# Altium schematic sheet TeensyCrashDAQ.SchDoc: Microcontroller with Sensors for Servos
size Letter; Author: Prof. Jeremy Daily; Organization: The University of Tulsa; Address1: Mechanical Engineering; Address2: 800 S. Tucker Dr; Address3: Tulsa, OK 74104; DocumentNumber: 1; Revision: 1; SheetNumber: 1; SheetTotal: 1
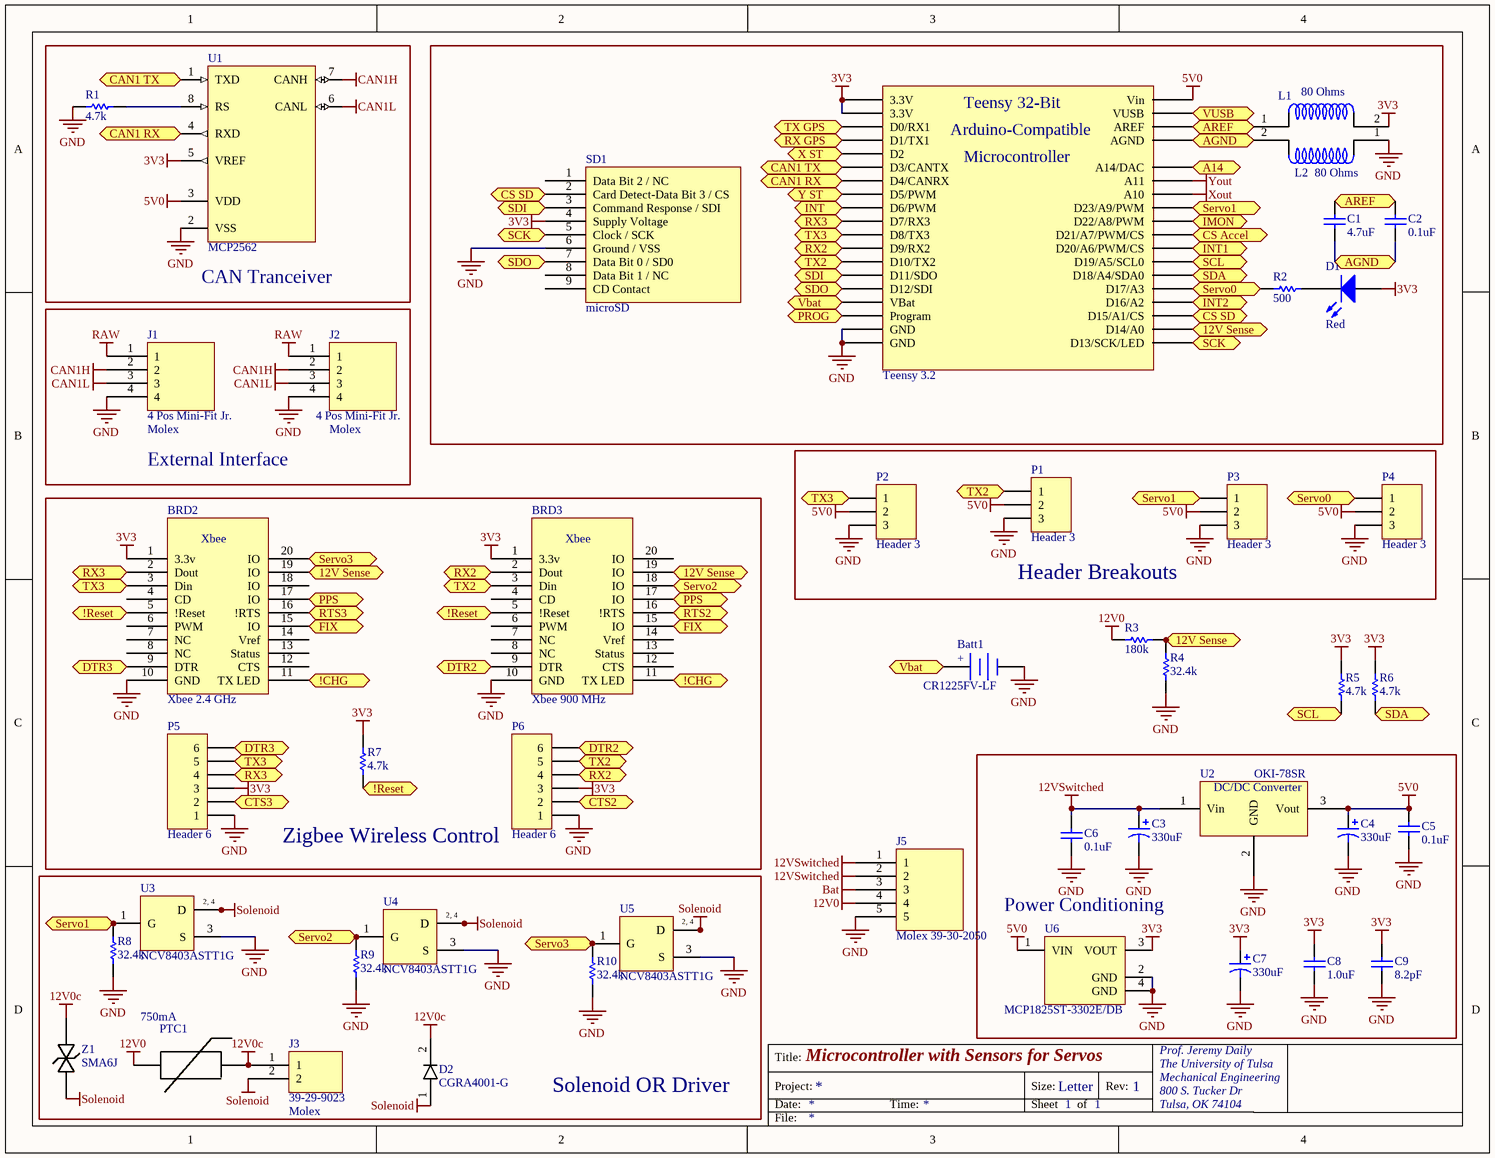
[diagram p0: TeensyCrashDAQ.SchDoc]

## Parts
Batt1  CR1225FV-LF  [Coin Cell with Tabs]
BRD1  Teensy 3.2  [Teensy]
BRD2  Xbee 2.4 GHz  [Xbee]
BRD3  Xbee 900 MHz  [Xbee]
C1  4.7uF  [1206]
C2  0.1uF  [0603]
C3  330uF  [Elec. Cap 5 x 10mm]
C4  330uF  [Elec. Cap 5 x 10mm]
C5  0.1uF  [0603]
C6  0.1uF  [0603]
C7  330uF  [Elec. Cap 5 x 10mm]
C8  1.0uF  [0603]
C9  8.2pF  [0603]
D1  Red  [0805 Polarized]
D2  CGRA4001-G  [SMA with A and K]
J1  4 Pos Mini-Fit Jr.  Manufacturer: Molex  [4 POS Vertical MINI-FIT JR]
J2  4 Pos Mini-Fit Jr.  Manufacturer: Molex  [4 POS Vertical MINI-FIT JR]
J3  39-29-9023  Manufacturer: Molex  [2 POS Vertical MINI-FIT JR]
J5  Molex 39-30-2050  [5 POS Vert MINI-FIT JR]
L1  80 Ohms  [0805]
L2  80 Ohms  [0805]
P1  Header 3  [HDR1X3]
P2  Header 3  [HDR1X3]
P3  Header 3  [HDR1X3]
P4  Header 3  [HDR1X3]
P5  Header 6  [HDR1X6]
P6  Header 6  [HDR1X6]
PTC1  750mA  [2920]
R1  4.7k  [0603]
R2  500  [0603]
R3  180k  [0603]
R4  32.4k  [0603]
R5  4.7k  [0603]
R6  4.7k  [0603]
R7  4.7k  [0603]
R8  32.4k  [0603]
R9  32.4k  [0603]
R10  32.4k  [0603]
SD1  microSD  [SD Card Holder]
U1  MCP2562  [SOIC-8]
U2  OKI-78SR  [78xx]
U3  NCV8403ASTT1G  [ONSC-SOT-223-4-318E-04_V]
U4  NCV8403ASTT1G  [ONSC-SOT-223-4-318E-04_V]
U5  NCV8403ASTT1G  [ONSC-SOT-223-4-318E-04_V]
U6  MCP1825ST-3302E/DB  [SOT-223-DB3_M]
Z1  SMA6J  [SMA]

## Blocks framed on the sheet
CAN Tranceiver: R1 U1
External Interface: J1 J2
Header Breakouts: P1-P4
Zigbee Wireless Control: BRD2 BRD3 P5 P6 R7
Power Conditioning: C3-C9 U2 U6
Solenoid OR Driver: D2 J3 PTC1 R8-R10 U3-U5 Z1

## Ports
12V Sense, !CHG, !Reset, A14, AGND, AREF, CAN1 RX, CAN1 TX, CS Accel, CS SD, CTS2, CTS3, DTR2, DTR3, FIX, IMON, INT, INT1, INT2, PPS, PROG, RTS2, RTS3, RX2, RX3, RX GPS, SCK, SCL, SDA, SDI, SDO, Servo0, Servo1, Servo2, Servo3, TX2, TX3, TX GPS, Vbat, VUSB, X ST, Y ST

## Nets
3V3: BRD1.16(3.3V) BRD1.31(3.3V) BRD2.1(3.3v) BRD3.1(3.3v) C7.1 C8.2 C9.2 D1.1(A) L1.2 P5.3 P6.3 R5.2 R6.2 R7.2 SD1.4(Supply_Voltage) U1.5(VREF) U6.3(VOUT)
5V0: BRD1.33(Vin) C4.1 C5.2 P1.2 P2.2 P3.2 P4.2 U1.3(VDD) U2.3(Vout) U6.1(VIN)
12V0: J5.4 PTC1.1 R3.1
12V0c: D2.2(K) J3.1 PTC1.2 Z1.1(A)
12VSwitched: C3.1 C6.2 J5.1 J5.2 U2.1(Vin)
Bat: J5.3
CAN1H: J1.2 J2.2 U1.7(CANH)
CAN1L: J1.3 J2.3 U1.6(CANL)
GND: Batt1.2(-) BRD1.14(GND) BRD1.17(GND) BRD2.10(GND) BRD3.10(GND) C3.2 C4.2 C5.1 C6.1 C7.2 C8.1 C9.1 J1.4 J2.4 J5.5 L2.1 P1.3 P2.3 P3.3 P4.3 P5.1 P6.1 R1.1 R4.1 R8.1 R9.1 R10.1 SD1.6(Ground_/_VSS) U1.2(VSS) U2.2(GND) U3.3(S) U4.3(S) U5.3(S) U6.2(GND) U6.4(GND)
RAW: J1.1 J2.1
Solenoid: D2.1(A) J3.2 U3.2(D) U3.4(D) U4.2(D) U4.4(D) U5.2(D) U5.4(D) Z1.2(K)
Xout: BRD1.36(A10)
Yout: BRD1.37(A11)
12V Sense: BRD1.21(D14/A0) BRD2.19(IO) BRD3.19(IO) R3.2 R4.2 ; port 12V Sense
!CHG: BRD2.11(TX_LED) BRD3.11(TX_LED) ; port !CHG
!Reset: BRD2.5(!Reset) BRD3.5(!Reset) R7.1 ; port !Reset
A14: BRD1.19(A14/DAC) ; port A14
AGND: BRD1.32(AGND) C1.1 C2.1 L2.2 ; port AGND
AREF: BRD1.35(AREF) C1.2 C2.2 L1.1 ; port AREF
CAN1 RX: BRD1.9(D4/CANRX) U1.4(RXD) ; port CAN1 RX
CAN1 TX: BRD1.10(D3/CANTX) U1.1(TXD) ; port CAN1 TX
CS Accel: BRD1.28(D21/A7/PWM/CS) ; port CS Accel
CS SD: BRD1.22(D15/A1/CS) SD1.2(Card_Detect-Data_Bit_3_/_CS) ; port CS SD
CTS2: P6.2 ; port CTS2
CTS3: P5.2 ; port CTS3
DTR2: BRD3.9(DTR) P6.6 ; port DTR2
DTR3: BRD2.9(DTR) P5.6 ; port DTR3
FIX: BRD2.15(IO) BRD3.15(IO) ; port FIX
IMON: BRD1.29(D22/A8/PWM) ; port IMON
INT: BRD1.7(D6/PWM) ; port INT
INT1: BRD1.27(D20/A6/PWM/CS) ; port INT1
INT2: BRD1.23(D16/A2) ; port INT2
PPS: BRD2.17(IO) BRD3.17(IO) ; port PPS
PROG: BRD1.18(Program) ; port PROG
RTS2: BRD3.16(!RTS) ; port RTS2
RTS3: BRD2.16(!RTS) ; port RTS3
RX2: BRD1.4(D9/RX2) BRD3.2(Dout) P6.4 ; port RX2
RX3: BRD1.6(D7/RX3) BRD2.2(Dout) P5.4 ; port RX3
RX GPS: BRD1.12(D1/TX1) ; port RX GPS
SCK: BRD1.20(D13/SCK/LED) SD1.5(Clock_/_SCK) ; port SCK
SCL: BRD1.26(D19/A5/SCL0) R5.1 ; port SCL
SDA: BRD1.25(D18/A4/SDA0) R6.1 ; port SDA
SDI: BRD1.2(D11/SDO) SD1.3(Command_Response_/_SDI) ; port SDI
SDO: BRD1.1(D12/SDI) SD1.7(Data_Bit_0_/_SD0) ; port SDO
Servo0: BRD1.24(D17/A3) P4.1 R2.2 ; port Servo0
Servo1: BRD1.30(D23/A9/PWM) P3.1 R8.2 U3.1(G) ; port Servo1
Servo2: BRD3.18(IO) R9.2 U4.1(G) ; port Servo2
Servo3: BRD2.20(IO) R10.2 U5.1(G) ; port Servo3
TX2: BRD1.3(D10/TX2) BRD3.3(Din) P1.1 P6.5 ; port TX2
TX3: BRD1.5(D8/TX3) BRD2.3(Din) P2.1 P5.5 ; port TX3
TX GPS: BRD1.13(D0/RX1) ; port TX GPS
Vbat: Batt1.1(+) BRD1.15(VBat) ; port Vbat
VUSB: BRD1.34(VUSB) ; port VUSB
X ST: BRD1.11(D2) ; port X ST
Y ST: BRD1.8(D5/PWM) ; port Y ST
NetD1_2: D1.2(K) R2.1
NetR1_2: R1.2 U1.8(RS)

Not connected (* = marked no-connect by the designer): BRD2 4(CD) 6(PWM) 7(NC) 8(NC) 12(CTS) 13(Status) 14(Vref) 18(IO); BRD3 4(CD) 6(PWM) 7(NC) 8(NC) 12(CTS) 13(Status) 14(Vref) 20(IO); SD1 1(Data_Bit_2_/_NC) 8(Data_Bit_1_/_NC) 9(CD_Contact)

## Notes on the sheet
- Title:
- Project:
- Date:
- Time:
- Sheet
- Size:
- Letter
- of
- Rev:
- File:
- (in symbol 7805) DC/DC Converter
- (in symbol NCV8403ASTT1G) 2, 4
- (in symbol Teensy) Teensy 32-Bit; Arduino-Compatible; Microcontroller

## Library data of the parts
Batt1 = CR2032 Battery Holder: Coin Cell Battery 3V 2-PIN VERT 48mAh 12.5 x 2.5mm; Manufacturer: Renata; Supplier 1: Mouser; Supplier Part Number 1: 614-CR1225FV-LF; PartNumber: CR1225FV-LF
BRD1 = Teensy: 32 Bit Arduino-Compatible Microcontroller; Manufacturer: PRJC; PartNumber: Teensy 3.2; Supplier 1: Sparkfun; Supplier Part Number 1: DEV-13736
BRD2 BRD3 = Xbee
C1 = Cap: 4.7µF ±10% 50V X7R Ceramic Capacitor -55°C ~ 125°C Surface Mount, MLCC 1206; Manufacturer: Samsung Electro-Mechanics America, Inc.; PartNumber: CL31B475KBHNNNE; Supplier 1: Digi-Key; Supplier Part Number 1: 1276-2789-1-ND
C2 C5 C6 = Cap: 0.10µF ±10% 50V X7R Ceramic Capacitor -55°C ~ 125°C Surface Mount, MLCC 0603 (1608 Metric) 0.063" L x 0.031" W (1.60mm x 0.80mm); Manufacturer: Murata Electronics North America; PartNumber: GRM188R71H104KA93D; Supplier 1: Digi-Key; Supplier Part Number 1: 490-1519-1-ND
C3 C4 C7 = SMD Elec: CAP ALUM 330UF 20% 50V RADIAL; Manufacturer: Panasonic Electronic Components; PartNumber: ECA-1HM331; Supplier 1: Digi-Key; Supplier Part Number 1: P5184-ND
C8 = Cap: 1µF ±10% 10V X5R Ceramic Capacitor -55°C ~ 85°C Surface Mount, MLCC 0603 (1608 Metric) 0.063" L x 0.031" W (1.60mm x 0.80mm); Manufacturer: Murata Electronics North America; PartNumber: GRM188R61A105KA61D; Supplier 1: Digi-Key; Supplier Part Number 1: 490-1543-1-ND
C9 = Cap: 8.2pF ±0.5pF 50V C0G, NP0 Ceramic Capacitor -55°C ~ 125°C Surface Mount, MLCC 0201 (0603 Metric) 0.024" L x 0.012" W (0.60mm x 0.30mm); Manufacturer: Murata Electronics North America; PartNumber: GRM0335C1H8R2DA01D; Supplier 1: Digi-Key; Supplier Part Number 1: 490-6133-2-ND
D1 = LED - SMD: LED RED DIFFUSED 0805 SMD; Manufacturer: OSRAM Opto Semiconductors Inc.; PartNumber: LS R976-NR-1; Supplier 1: Digi-Key; Supplier Part Number 1: 475-1278-1-ND
D2 = Diode: DIODE GEN PURP 50V 1A DO214AC; Supplier 1: Digi-Key
J1 J2 = 4 Pos Header Vert: CONN HEADER 4POS 4.2MM VERT TIN; Supplier 1: Mouser; Supplier 2: Mouser; PartNumber: 39-29-9040; Supplier Part Number 1: 538-39-29-9040; Supplier Part Number 2: 538-39-29-9040
J3 = 2 Pos Header Vert: 2 Positions Header, Shrouded Connector Through Hole Tin; PartNumber: 39-29-9023; Supplier 1: Digi-Key; Supplier 2: Mouser; Supplier Part Number 1: WM3853-ND; Supplier Part Number 2: 538-39-29-9023
J5 = 5 Pos Header Vert: Molex Mint Fit Jr 5 CKT VERT HEADER
L1 L2 = Ferrite Bead: Ferrite Bead 80ohms 100MHz 5A Monolithic 0805 SMD; Manufacturer: Laird Technologies; PartNumber: HI0805R800R-10; Supplier 1: Mouser; Supplier Part Number 1: 875-HI0805R800R-10
P1-P4 = Header 3: Header, 3-Pin; LatestRevisionDate: 17-Jul-2002; LatestRevisionNote: Re-released for DXP Platform.; Publisher: Altium Limited
P5 P6 = Header 6: Header, 6-Pin; LatestRevisionDate: 17-Jul-2002; LatestRevisionNote: Re-released for DXP Platform.; Publisher: Altium Limited
PTC1 = PTC: PTC RESETBL 60V 750MA SMD 2920; Manufacturer: Littelfuse; PartNumber: 2920L075/60MR; Supplier 1: Digi-Key; Supplier Part Number 1: F5633CT-ND
R1 R5-R7 = Chip Resistor: 4.7k Ohm ±1% 0.1W, 1/10W Surface Mount Resistor Thick Film ±100ppm/°C 0603; Manufacturer: Panasonic Electronic Components; PartNumber: ERJ-3EKF4701V; Supplier 1: Digi-Key; Supplier Part Number 1: P4.70KHCT-ND
R2 R3 = Chip Resistor: Manufacturer: Panasonic Electronic Components; PartNumber: ERJ-3EKF1001V; Supplier 1: Digi-Key; Supplier Part Number 1: P1.00KHCT-ND
R4 R8-R10 = Chip Resistor: 32.4k Ohm ±1% 0.1W, 1/10W Surface Mount Resistor Thick Film ±100ppm/°C 0603; Manufacturer: Panasonic Electronic Components; PartNumber: ERJ-3EKF3242V; Supplier 1: Digi-Key; Supplier Part Number 1: P32.4KHCT-ND
SD1 = SD Card Holder: CONN MICRO SD CARD PUSH-PUSH R/A; Manufacturer: Amphenol Commercial Products; PartNumber: 101-00660-68-6; Supplier 1: Digi-Key; Supplier Part Number 1: 101-00660-68-6-1-ND
U1 = MCP2551-I/P: High-Speed CAN Transceiver, 8-Pin PDIP, Industrial Temperature; Manufacturer: Microchip; PartNumber: MCP2562FD-E/P; DatasheetVersion: revF, Jul-2010; PackageVersion: revBB, Aug-2009; PackageReference: PDIP300-P8; PackageDescription: 8-Lead Plastic Dual In-Line (P) - 300 mil Body [PDIP]; Supplier 1: Mouser; Supplier Part Number 1: 579-MCP2562FD-E/P; Supplier 2: Farnell; Supplier Part Number 2: 1292240; Supplier 3: Newark; Supplier Part Number 3: 61K2947; Supplier 4: Mouser; Supplier Part Number 4: 579-MCP2551-I/P; Mounting Technology: Through Hole; Code_JEDEC: MS-001; ComponentLink1Description: Manufacturer URL; ComponentLink1URL: http://www.microchip.com/; ComponentLink2Description: Datasheet; ComponentLink2URL: http://ww1.microchip.com/downloads/en/DeviceDoc/21667F.pdf; ComponentLink3Description: Package Specification; ComponentLink3URL: http://www.microchip.com/stellent/groups/techpub_sg/documents/packagingspec/en012702.pdf
U2 = 7805: 5V DC/DC Converter (7805 replacement); Manufacturer: Murata Power Solutions; PartNumber: OKI-78SR-5/1.5-W36H-C; Supplier 1: Mouser; Supplier 2: Digi-Key; Supplier Part Number 1: 580-OKI78SR51.5W36HC; Supplier Part Number 2: 811-2692-ND
U3-U5 = NCV8403ASTT1G: Self-Protected Low Side Driver with Temperature and Current Limit, 4-Pin SOT-223, Pb-Free, Tape and Reel; Manufacturer: On Semiconductor; Channel Polarity: N Channel; DatasheetVersion: Rev. 5; PackageVersion: Rev. N, 08/2009; PackageReference: SOT-223-4-318E-04; PackageDescription: 4-Pin Small Outline Transistor, Body 6.5 x 3.5 mm, Pitch 2.3 mm; Supplier 1: Digi-Key; Supplier Part Number 1: NCV8403ASTT1G-ND; Supplier 2: Mouser; Supplier Part Number 2: 863-NCV8403ASTT1G; Packing: Tape and Reel; RoHS: Pb-Free; Mounting Technology: Surface Mount; PartNumber: NCV8403ASTT1G; ComponentLink1Description: Manufacturer URL; ComponentLink1URL: http://www.onsemi.com/; ComponentLink2Description: Datasheet; ComponentLink2URL: http://www.onsemi.com/pub_link/Collateral/NCV8403-D.PDF; ComponentLink3Description: Package Specification; ComponentLink3URL: http://www.onsemi.com/pub_link/Collateral/318E-04.PDF
U6 = MCP1825ST-3302E/DB: 500 mA, Low Voltage, Low Quiescent Current LDO Regulator, 3-Pin SOT-223, Extended Temperature, Tape and Reel; Manufacturer: Microchip; DatasheetVersion: revB, Feb-2008; PackageVersion: revBB, Aug-2009; PackageReference: SOT-223-DB3; PackageDescription: 3-Lead Plastic Small Outline Transistor (DB) [SOT-223]; Supplier 1: Digi-Key; Supplier Part Number 1: MCP1825ST-3302E/DBTR-ND; Supplier 2: Mouser; Supplier Part Number 2: 579-MCP1825ST3302EDB; Mounting Technology: Surface Mount; PartNumber: MCP1825ST-3302E/DB; ComponentLink1Description: Manufacturer URL; ComponentLink1URL: http://www.microchip.com/; ComponentLink2Description: Datasheet; ComponentLink2URL: http://ww1.microchip.com/downloads/en/DeviceDoc/22056b.pdf; ComponentLink3Description: Package Specification; ComponentLink3URL: http://www.microchip.com/stellent/groups/techpub_sg/documents/packagingspec/en012702.pdf
Z1 = Zener - Bidirectional: TVS DIODE 15VWM 24.4VC SMA; Manufacturer: STMicroelectronics; PartNumber: P6KE18CA; Supplier 1: Mouser; Supplier Part Number 1: 511-P6KE18CA